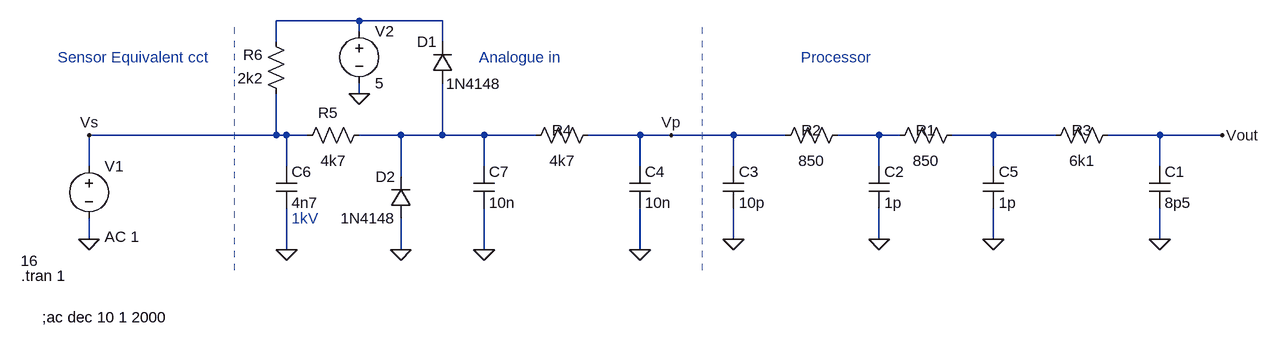
[diagram p0: schematic SPC572L_ADC_ip_overvolts.asc]
SPC572L_ADC_ip_overvolts.asc, the LTspice schematic file:
Version 4
SHEET 1 920 680
WIRE -480 32 -608 32
WIRE -352 32 -480 32
WIRE -480 48 -480 32
WIRE -608 64 -608 32
WIRE -352 64 -352 32
WIRE -480 144 -480 128
WIRE -608 208 -608 144
WIRE -608 208 -896 208
WIRE -592 208 -608 208
WIRE -560 208 -592 208
WIRE -416 208 -480 208
WIRE -352 208 -352 128
WIRE -352 208 -416 208
WIRE -288 208 -352 208
WIRE -208 208 -288 208
WIRE -48 208 -128 208
WIRE 0 208 -48 208
WIRE 96 208 0 208
WIRE 176 208 96 208
WIRE 320 208 256 208
WIRE 352 208 320 208
WIRE 496 208 432 208
WIRE 592 208 496 208
WIRE 752 208 672 208
WIRE 848 208 752 208
WIRE -896 256 -896 208
WIRE -592 256 -592 208
WIRE -288 256 -288 208
WIRE -48 256 -48 208
WIRE 96 256 96 208
WIRE 320 256 320 208
WIRE 496 256 496 208
WIRE 752 256 752 208
WIRE -416 272 -416 208
WIRE -896 368 -896 336
WIRE 96 368 96 320
WIRE 320 368 320 320
WIRE 496 368 496 320
WIRE 752 368 752 320
WIRE -592 384 -592 320
WIRE -416 384 -416 336
WIRE -288 384 -288 320
WIRE -48 384 -48 320
FLAG 320 368 0
FLAG 752 368 0
FLAG -896 368 0
FLAG 848 208 Vout
FLAG 96 368 0
FLAG -48 384 0
FLAG 496 368 0
FLAG -592 384 0
FLAG -288 384 0
FLAG 0 208 Vp
FLAG -896 208 Vs
FLAG -416 384 0
FLAG -480 144 0
SYMBOL res 272 192 R90
WINDOW 0 24 56 VBottom 2
WINDOW 3 40 56 VTop 2
SYMATTR InstName R2
SYMATTR Value 850
SYMBOL res 688 192 R90
WINDOW 0 24 56 VBottom 2
WINDOW 3 40 56 VTop 2
SYMATTR InstName R3
SYMATTR Value 6k1
SYMBOL cap 736 256 R0
SYMATTR InstName C1
SYMATTR Value 8p5
SYMBOL cap 304 256 R0
SYMATTR InstName C2
SYMATTR Value 1p
SYMBOL res -112 192 R90
WINDOW 0 24 56 VBottom 2
WINDOW 3 40 56 VTop 2
SYMATTR InstName R4
SYMATTR Value 4k7
SYMBOL voltage -896 240 R0
WINDOW 123 24 124 Left 2
WINDOW 39 0 0 Left 2
WINDOW 3 -105 161 Left 2
SYMATTR Value2 AC 1
SYMATTR Value 16
SYMATTR InstName V1
SYMBOL cap 80 256 R0
SYMATTR InstName C3
SYMATTR Value 10p
SYMBOL cap -64 256 R0
SYMATTR InstName C4
SYMATTR Value 10n
SYMBOL res 448 192 R90
WINDOW 0 24 56 VBottom 2
WINDOW 3 40 56 VTop 2
SYMATTR InstName R1
SYMATTR Value 850
SYMBOL cap 480 256 R0
SYMATTR InstName C5
SYMATTR Value 1p
SYMBOL res -464 192 R90
WINDOW 0 -3 64 VBottom 2
WINDOW 3 40 56 VTop 2
SYMATTR InstName R5
SYMATTR Value 4k7
SYMBOL cap -608 256 R0
SYMATTR InstName C6
SYMATTR Value 4n7
SYMBOL res -592 160 R180
WINDOW 0 36 76 Left 2
WINDOW 3 36 40 Left 2
SYMATTR InstName R6
SYMATTR Value 2k2
SYMBOL cap -304 256 R0
SYMATTR InstName C7
SYMATTR Value 10n
SYMBOL diode -336 128 R180
WINDOW 0 24 64 Left 2
WINDOW 3 -74 -1 Left 2
SYMATTR InstName D1
SYMATTR Value 1N4148
SYMBOL diode -400 336 R180
WINDOW 0 24 64 Left 2
WINDOW 3 24 0 Left 2
SYMATTR InstName D2
SYMATTR Value 1N4148
SYMBOL voltage -480 32 R0
WINDOW 123 0 0 Left 2
WINDOW 39 0 0 Left 2
SYMATTR InstName V2
SYMATTR Value 5
TEXT -296 88 Left 2 ;Analogue in
TEXT 200 88 Left 2 ;Processor
TEXT -1000 424 Left 2 !.tran 1
TEXT -944 88 Left 2 ;Sensor Equivalent cct
TEXT -584 336 Left 2 ;1kV
TEXT -968 488 Left 2 !;ac dec 10 1 2000
LINE Normal 48 416 48 32 2
LINE Normal -672 416 -672 32 2

The netlist it stands for:
* SPC572L_ADC_ip_overvolts.asc
R2 N003 Vp 850
R3 Vout N004 6k1
C1 Vout 0 8p5
C2 N003 0 1p
R4 Vp N002 4k7
V1 Vs 0 16 AC 1
C3 Vp 0 10p
C4 Vp 0 10n
R1 N004 N003 850
C5 N004 0 1p
R5 N002 Vs 4k7
C6 Vs 0 4n7
R6 Vs N001 2k2
C7 N002 0 10n
D1 N002 N001 1N4148
D2 0 N002 1N4148
V2 N001 0 5
.model D D
.lib standard.dio
* Analogue in
* Processor
.tran 1
* Sensor Equivalent cct
* 1kV
;ac dec 10 1 2000
.backanno
.end